# EAGLE design secondary-power-board (EAGLE 7.2.0)
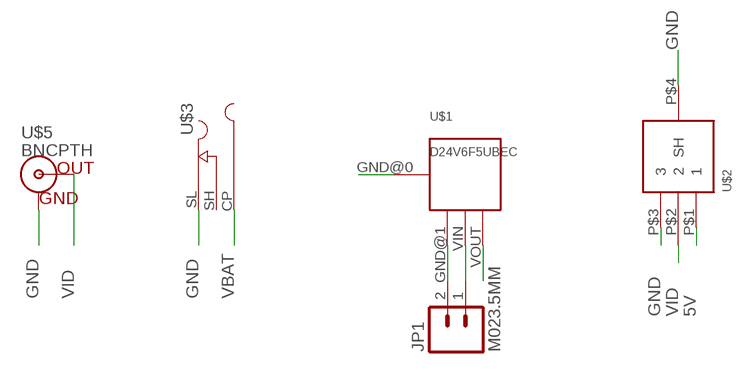
[diagram p0: schematic, sheet 1]

## Parts
JP1  M023.5MM  [SCREWTERMINAL-3.5MM-2]
U$1  D24V6F5UBEC  [P2177]
U$2  TRA3M  [TRA3M]
U$3  L722RAS  [L722RAS]
U$5  BNCPTH  [BNC]

## Nets
5V: U$1.VOUT U$2.P$1
GND: JP1.2 U$1.GND@0 U$1.GND@1 U$2.P$3 U$2.P$4(SH) U$3.SL(SLEEVE) U$5.GND
VBAT: JP1.1 U$1.VIN U$3.CP(CENTRE)
VID: U$2.P$2 U$5.S(OUT)
Unconnected: U$3.SH(SHUNT)

## Library data of the parts
JP1 = SparkFun-Connectors:M02: Standard 2-pin 0.1" header. Use with - straight break away headers ( PRT-00116) - right angle break away headers (PRT-00553) - swiss pins (PRT-00743) - machine pins (PRT-00117) - female headers (PRT-00115) Molex polarized connector foot print use with: PRT-08233 with associated crimp pins and housings. 2.54_SCREWTERM for use with PRT-10571. 3.5mm Screw Terminal footprints for PRT-08084 5mm Screw Terminal footprints for use with PRT-08433
U$1 = custom-parts:D24V6F5
U$2 = custom-parts:TRA3M
U$3 = custom-parts:L722RAS
U$5 = SparkFun-Connectors:BNC: BNC Connector, Mouser Part# 5227161

## Board
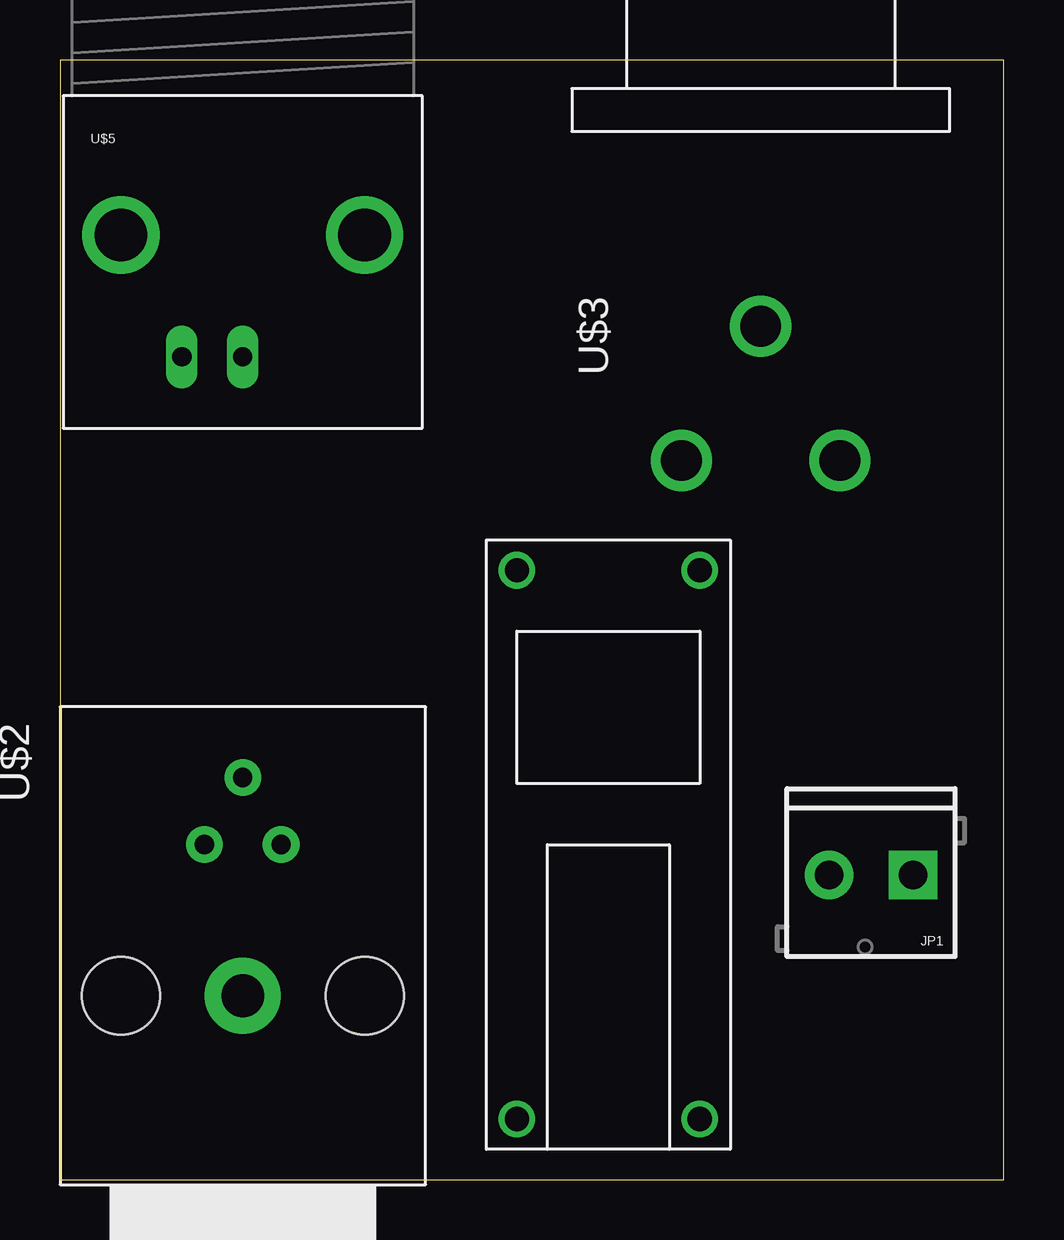
[diagram p1: board, top side]
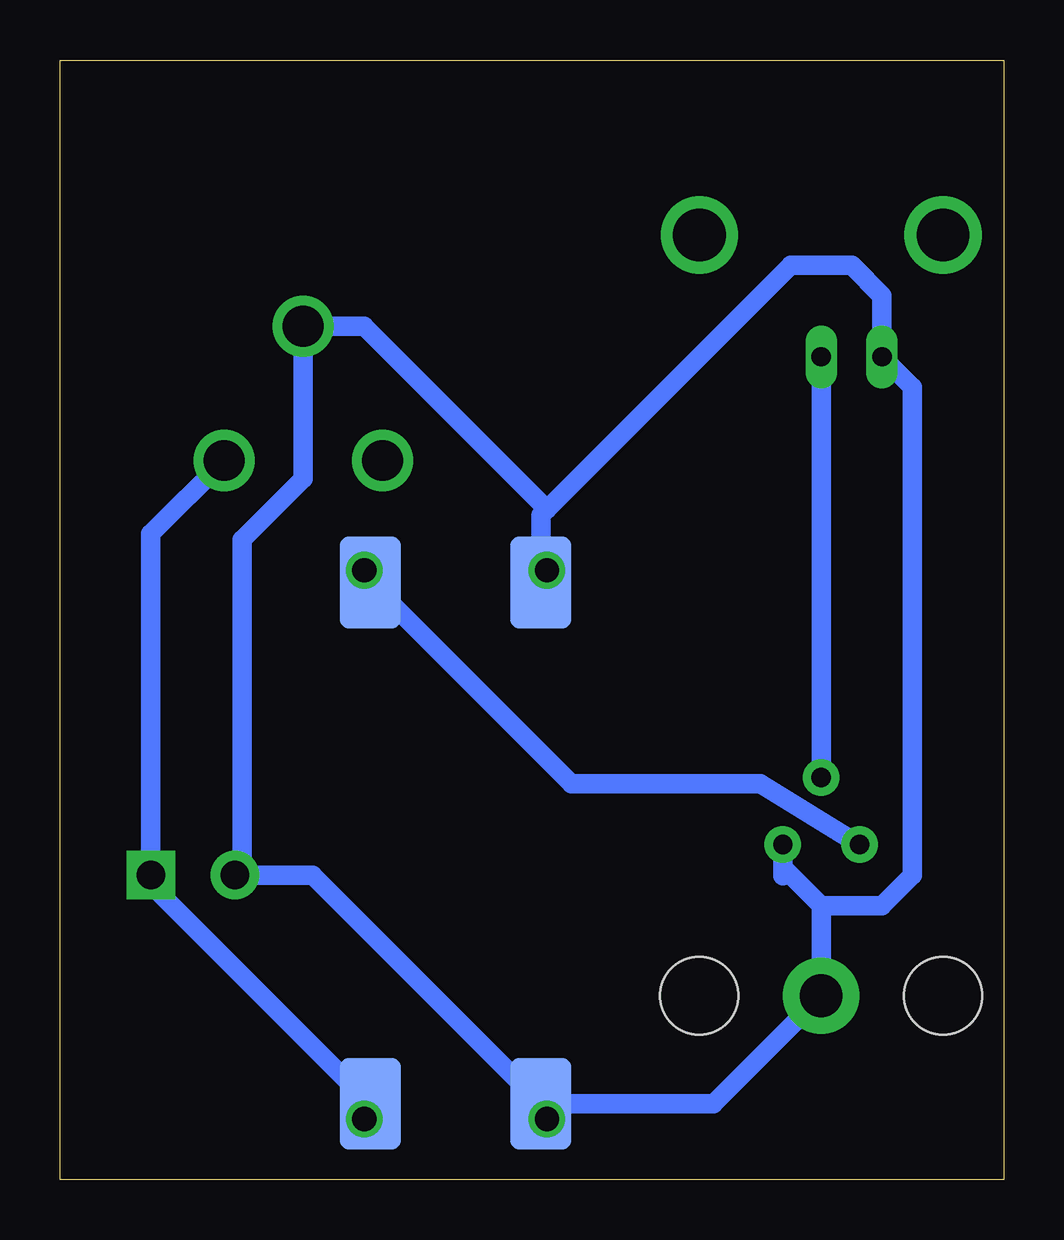
[diagram p2: board, bottom side, seen from below]

Size 39.35 x 46.66 mm. Coordinates in mm from the lower left corner, seen from the top.
Outline: 0,0 39.35,0 39.35,46.66 0,46.66 0,0
Copper layers (1*16): Top 0.035mm / dielectric 1.5mm / Bottom 0.035mm
Design rules: minimum track width 10mil, minimum drill 24mil, track to track 8mil, track to pad 8mil, pad to pad 8mil, via to via 8mil, smd to smd 8mil, copper to edge 40mil, drill to drill 8mil, minimum pad ring 10mil, minimum via ring 8mil, stop-mask expansion 4mil, vias tented up to drill 0mil, thermal gap 10mil

### Footprints (pad centres in the part's own frame; a part is rotated, then mirrored left to right if it is on the bottom)
SCREWTERMINAL-3.5MM-2 = drill 1.2 pad 2.032 square: 1 0,0 | drill 1.2 pad 2.032: 2 3.5,0
P2177 = smd 2.54 x 3.81 bottom: GND@0 -3.556,-1.778; GND@1 -3.556,-23.495; VIN 3.556,-23.495; VOUT 3.556,-1.778 | drill 1.016: P$1 -3.81,-1.27; P$2 3.81,-1.27; P$3 -3.81,-24.13; P$4 3.81,-24.13
TRA3M = drill 0.8 pad 1.524: P$1 0,-1.6; P$2 -2.794,0; P$3 0,1.6 | drill 1.778 pad 3.175: P$4 6.299,0 | hole 3.251: 6.299,5.08; 6.299,-5.08
L722RAS = drill 1.7: CP 5.588,3.302; SH 5.588,-3.302; SL 0,0
BNC = drill 2.2: 3 -5.08,5.08; 4 5.08,5.08 | drill 0.8 long: GND -2.54,0; S 0,0

### Placement (x,y rotation side)
JP1  35.56,12.7 180 top
U$1  22.86,26.67 0 top
U$2  7.62,13.97 270 top
U$3  29.21,35.56 270 top
U$5  7.62,34.29 0 top

### Tracks (layer width: path | path; a pad name or v marks a point on that pad's centre or on a via)
5V
  Bottom 0.813: U$2.P$1 10.16,16.51 18.03,16.51 U$1.VOUT
GND
  Bottom 0.813: 7.62,11.43 5.08,11.43 3.81,12.7 3.81,33.02 U$5.GND 5.08,36.83 6.35,38.1 8.89,38.1 19.05,27.94 | 7.62,11.43 9.22,13.03 | 9.22,13.03 U$2.P$3 | 7.62,11.43 U$2.P$4 12.12,3.17 U$1.GND@1 28.83,12.7 31.75,12.7 | 9.22,12.68 9.22,13.03 | 31.75,12.7 JP1.2 | 19.05,27.94 19.3,27.69 U$1.GND@0 | 19.05,27.94 26.67,35.56 U$3.SL 29.21,29.21 31.75,26.67 31.75,12.7
VBAT
  Bottom 0.813: U$1.VIN 35.56,12.32 JP1.1 35.56,26.92 U$3.CP
VID
  Bottom 0.813: U$5.S U$2.P$2